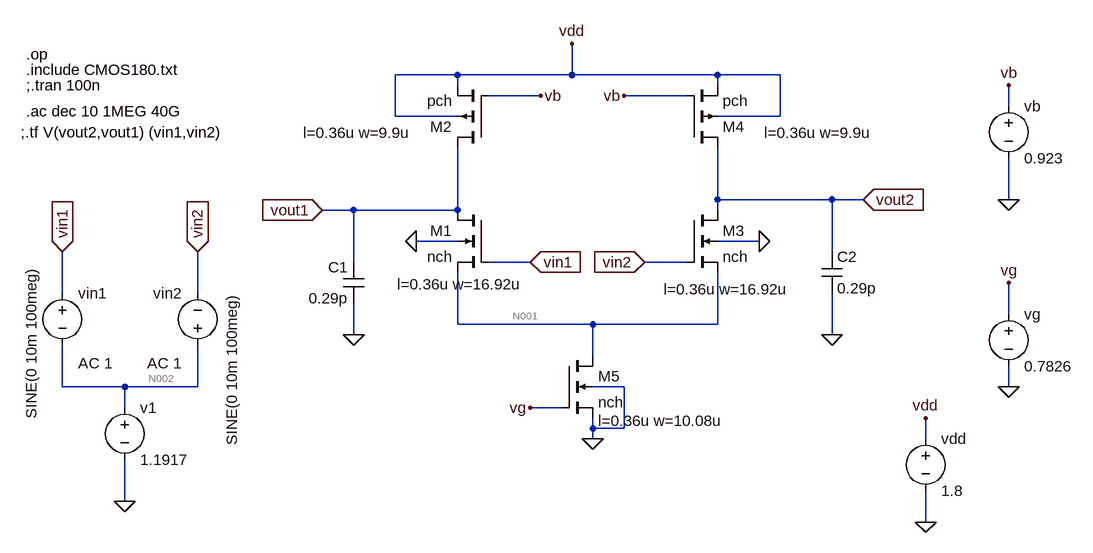
[diagram p0: schematic differential amplifier - Copy.asc]
differential amplifier - Copy.asc, the LTspice schematic file:
Version 4
SHEET 1 1088 756
WIRE -16 48 -112 48
WIRE 160 48 160 0
WIRE 160 48 -16 48
WIRE 384 48 160 48
WIRE 480 48 384 48
WIRE -16 64 -16 48
WIRE 384 64 384 48
WIRE 112 80 32 80
WIRE 336 80 240 80
WIRE 832 96 832 64
WIRE -112 112 -112 48
WIRE -16 112 -112 112
WIRE 480 112 480 48
WIRE 480 112 384 112
WIRE 384 240 384 160
WIRE 560 240 384 240
WIRE 608 240 560 240
WIRE 832 240 832 176
WIRE -176 256 -224 256
WIRE -16 256 -16 160
WIRE -16 256 -176 256
WIRE 384 256 384 240
WIRE -16 304 -80 304
WIRE 448 304 384 304
WIRE 560 320 560 240
WIRE -176 336 -176 256
WIRE 96 336 32 336
WIRE 336 336 272 336
WIRE -624 384 -624 320
WIRE -416 384 -416 320
WIRE 832 416 832 368
WIRE -16 432 -16 352
WIRE 192 432 -16 432
WIRE 384 432 384 352
WIRE 384 432 192 432
WIRE -176 448 -176 400
WIRE 560 448 560 384
WIRE 192 480 192 432
WIRE -624 528 -624 464
WIRE -528 528 -624 528
WIRE -416 528 -416 464
WIRE -416 528 -528 528
WIRE 240 528 192 528
WIRE 832 528 832 496
WIRE -528 560 -528 528
WIRE 144 560 96 560
WIRE 192 592 192 576
WIRE 240 592 240 528
WIRE 240 592 192 592
WIRE 192 608 192 592
WIRE 704 608 704 576
WIRE -528 704 -528 640
WIRE 704 736 704 688
FLAG 160 0 vdd
FLAG 608 240 vout2
IOPIN 608 240 In
FLAG 560 448 0
FLAG -528 704 0
FLAG -624 320 vin1
IOPIN -624 320 In
FLAG -416 320 vin2
IOPIN -416 320 In
FLAG 96 336 vin1
IOPIN 96 336 In
FLAG 272 336 vin2
IOPIN 272 336 In
FLAG 704 576 vdd
FLAG 704 736 0
FLAG 448 304 0
FLAG -224 256 vout1
IOPIN -224 256 In
FLAG -176 448 0
FLAG 112 80 vb
FLAG 240 80 vb
FLAG 832 64 vb
FLAG 832 240 0
FLAG 192 608 0
FLAG 96 560 vg
FLAG 832 528 0
FLAG 832 368 vg
FLAG -80 304 0
SYMBOL nmos4 32 256 M0
WINDOW 123 -52 114 Left 2
SYMATTR Value2 l=0.36u w=16.92u
SYMATTR InstName M1
SYMATTR Value nch
SYMBOL pmos4 32 160 R180
WINDOW 123 120 23 Left 2
SYMATTR Value2 l=0.36u w=9.9u
SYMATTR InstName M2
SYMATTR Value pch
SYMBOL nmos4 336 256 R0
WINDOW 123 -35 122 Left 2
SYMATTR Value2 l=0.36u w=16.92u
SYMATTR InstName M3
SYMATTR Value nch
SYMBOL cap 544 320 R0
SYMATTR InstName C2
SYMATTR Value 0.29p
SYMBOL pmos4 336 160 M180
WINDOW 123 120 23 Left 2
SYMATTR Value2 l=0.36u w=9.9u
SYMATTR InstName M4
SYMATTR Value pch
SYMBOL voltage -528 544 R0
WINDOW 123 0 0 Left 0
WINDOW 39 0 0 Left 0
SYMATTR InstName v1
SYMATTR Value 1.1917
SYMBOL voltage -624 368 R0
WINDOW 3 -48 -25 VRight 2
WINDOW 123 24 124 Left 2
WINDOW 39 0 0 Left 0
SYMATTR Value SINE(0 10m 100meg)
SYMATTR Value2 AC 1
SYMATTR InstName vin1
SYMBOL voltage -416 480 R180
WINDOW 0 24 96 Left 2
WINDOW 3 -53 -138 VRight 2
WINDOW 123 24 -12 Left 2
WINDOW 39 0 0 Left 0
SYMATTR InstName vin2
SYMATTR Value SINE(0 10m 100meg)
SYMATTR Value2 AC 1
SYMBOL voltage 704 592 R0
WINDOW 123 0 0 Left 0
WINDOW 39 0 0 Left 0
SYMATTR InstName vdd
SYMATTR Value 1.8
SYMBOL cap -160 336 M0
SYMATTR InstName C1
SYMATTR Value 0.29p
SYMBOL voltage 832 80 R0
WINDOW 123 0 0 Left 0
WINDOW 39 0 0 Left 0
SYMATTR InstName vb
SYMATTR Value 0.923
SYMBOL nmos4 144 480 R0
WINDOW 123 56 100 Left 2
SYMATTR InstName M5
SYMATTR Value nch
SYMATTR Value2 l=0.36u w=10.08u
SYMBOL voltage 832 400 R0
WINDOW 123 0 0 Left 0
WINDOW 39 0 0 Left 0
SYMATTR InstName vg
SYMATTR Value 0.7826
TEXT -680 40 Left 2 !.include CMOS180.txt
TEXT -680 16 Left 2 !.op
TEXT -688 136 Left 2 !;.tf V(vout2,vout1) (vin1,vin2)
TEXT -680 64 Left 2 !;.tran 100n
TEXT -680 104 Left 2 !.ac dec 10 1MEG 40G

The netlist it stands for:
* differential amplifier - Copy.asc
M1 vout1 vin1 N001 0 nch l=0.36u w=16.92u
M2 vout1 vb vdd vdd pch l=0.36u w=9.9u
M3 vout2 vin2 N001 0 nch l=0.36u w=16.92u
C2 vout2 0 0.29p
M4 vout2 vb vdd vdd pch l=0.36u w=9.9u
v1 N002 0 1.1917
vin1 vin1 N002 SINE(0 10m 100meg) AC 1
vin2 N002 vin2 SINE(0 10m 100meg) AC 1
vdd vdd 0 1.8
C1 vout1 0 0.29p
vb vb 0 0.923
M5 N001 vg 0 0 nch l=0.36u w=10.08u
vg vg 0 0.7826
.model NMOS NMOS
.model PMOS PMOS
.lib standard.mos
.include CMOS180.txt
.op
;.tf V(vout2,vout1) (vin1,vin2)
;.tran 100n
.ac dec 10 1MEG 40G
.backanno
.end

* Results of the author's LTspice run, read from the files saved beside the schematic
* Operating Point, zero values left out:
*   V(vout1) = 1.124 V
*   V(vin1) = 1.192 V
*   V(n001) = 449.7 mV
*   V(vb) = 923 mV
*   V(vdd) = 1.8 V
*   V(vout2) = 1.124 V
*   V(vin2) = 1.192 V
*   V(n002) = 1.192 V
*   V(vg) = 782.6 mV
*   Id(M4) = -167.6 µA
*   Is(M4) = 167.6 µA
*   Id(M2) = -167.6 µA
*   Is(M2) = 167.6 µA
*   Id(M5) = 335.3 µA
*   Is(M5) = -335.3 µA
*   Id(M3) = 167.6 µA
*   Ib(M3) = -1.594 pA
*   Is(M3) = -167.6 µA
*   Id(M1) = 167.6 µA
*   Ib(M1) = -1.594 pA
*   Is(M1) = -167.6 µA
*   I(Vdd) = -335.3 µA
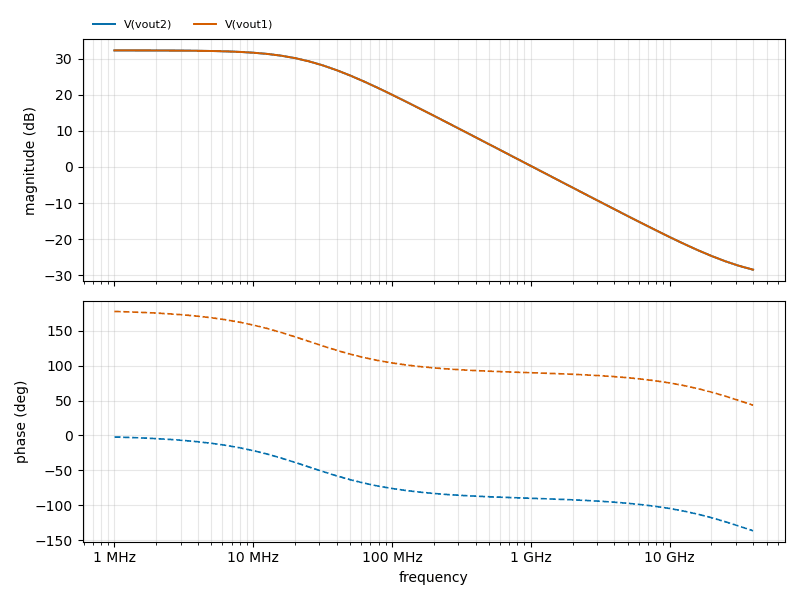
[diagram p1: AC Analysis of differential amplifier - Copy.asc, plotted from the saved traces]
* AC Analysis, 1 run:
*   V(vout2): 32.31 dB at 1 MHz, -28.47 dB at 40 GHz, peak 32.31 dB at 1 MHz, 3 dB below the peak at 25.11 MHz
*   V(vout1): 32.31 dB at 1 MHz, -28.47 dB at 40 GHz, peak 32.31 dB at 1 MHz, 3 dB below the peak at 25.11 MHz